# Altium schematic sheet Memory.SchDoc
size A
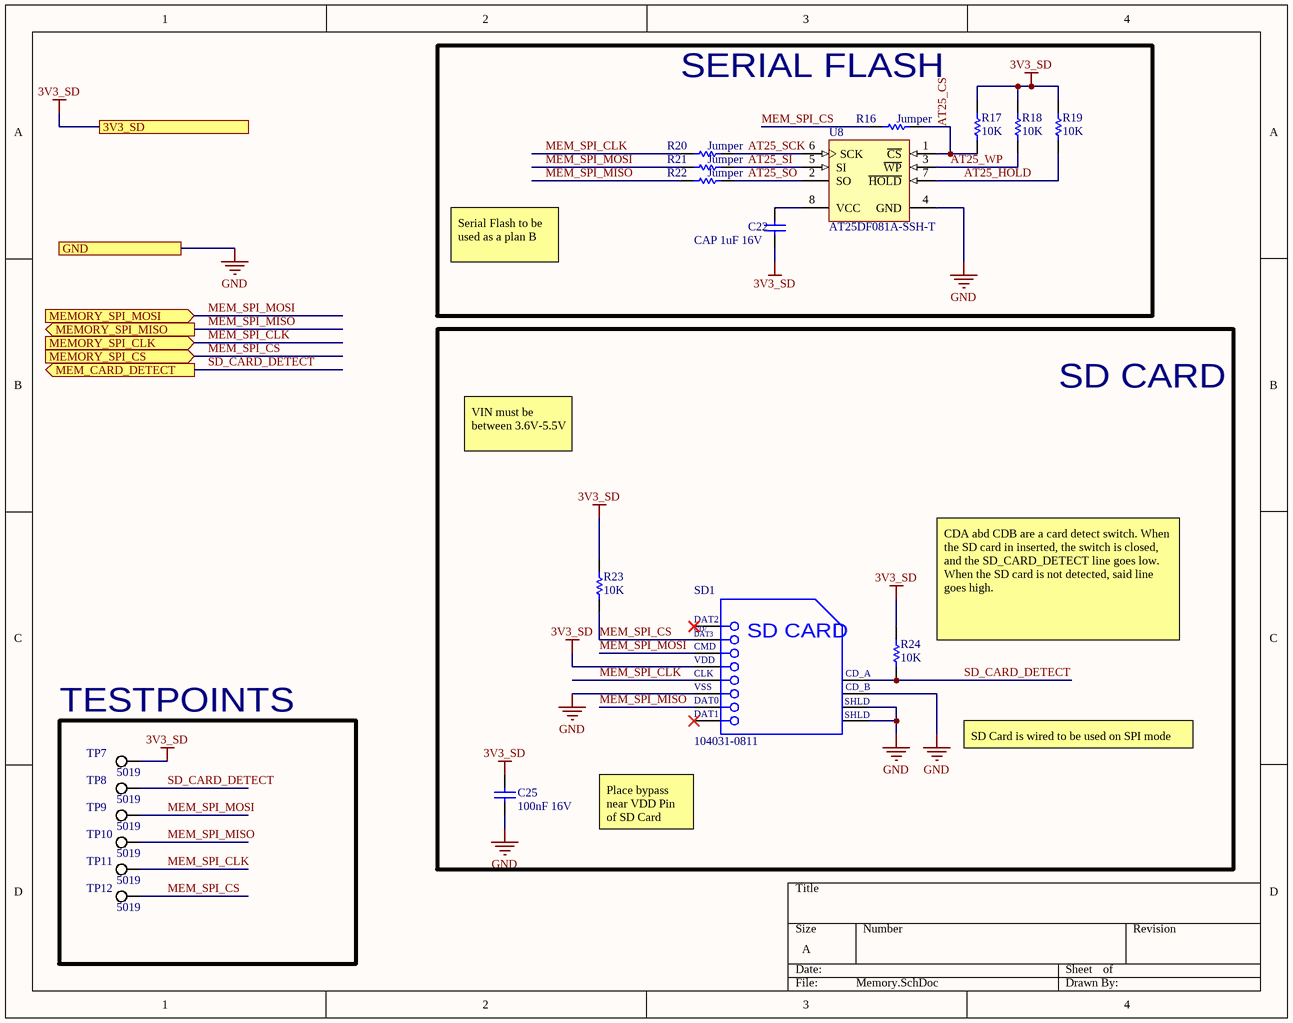
[diagram p0: Memory.SchDoc]

## Parts
C22  CAP 1uF 16V  [CAPC0603(1608)100_N]
C25  100nF 16V  [CAPC0603(1608)100_N]
R16  Jumper  [RESC0603(1608)_N]
R17  10K  [RESC0402(1005)_M]
R18  10K  [RESC0402(1005)_M]
R19  10K  [RESC0402(1005)_M]
R20  Jumper  [RESC0603(1608)_N]
R21  Jumper  [RESC0603(1608)_N]
R22  Jumper  [RESC0603(1608)_N]
R23  10K  [RESC0402(1005)_M]
R24  10K  [RESC0402(1005)_M]
SD1  104031-0811  [MOLX-104031-0811_V]
TP7  5019  [KSTN-5019_V]
TP8  5019  [KSTN-5019_V]
TP9  5019  [KSTN-5019_V]
TP10  5019  [KSTN-5019_V]
TP11  5019  [KSTN-5019_V]
TP12  5019  [KSTN-5019_V]
U8  AT25DF081A-SSH-T  [AT25DF081A-SSH-T]

## Blocks framed on the sheet
SERIAL FLASH: C22 R16-R22 U8
SD CARD: C25 R23 R24 SD1
TESTPOINTS: TP7-TP12

## Ports
3V3_SD, GND, MEM_CARD_DETECT (out), MEMORY_SPI_CLK (in), MEMORY_SPI_CS (in), MEMORY_SPI_MISO (out), MEMORY_SPI_MOSI (in)

## Nets
3V3_SD: C22.1 C25.2 R17.1 R18.1 R19.1 R23.1 R24.1 SD1.4(VDD) TP7.1 ; port 3V3_SD
GND: C25.1 SD1.6(VSS2) SD1.10(CD_B) SD1.11(SHLD1) SD1.12(SHLD2) U8.4(GND) ; port GND
AT25_CS: R16.2 R17.2 U8.1(~{CS})
AT25_HOLD: R19.2 U8.7(~{HOLD})
AT25_SCK: R20.2 U8.6(SCK)
AT25_SI: R21.2 U8.5(SI)
AT25_SO: R22.2 U8.2(SO)
AT25_WP: R18.2 U8.3(~{WP})
MEM_SPI_CLK: R20.1 SD1.5(CLK) TP11.1 ; port MEMORY_SPI_CLK
MEM_SPI_CS: R16.1 R23.2 SD1.2(CMD) TP12.1 ; port MEMORY_SPI_CS
MEM_SPI_MISO: R22.1 SD1.7(DAT0) TP10.1 ; port MEMORY_SPI_MISO
MEM_SPI_MOSI: R21.1 SD1.3(VSS1) TP9.1 ; port MEMORY_SPI_MOSI
SD_CARD_DETECT: R24.2 SD1.9(CD_A) TP8.1 ; port MEM_CARD_DETECT
NetC22_2: C22.2 U8.8(VCC)

Not connected (* = marked no-connect by the designer): SD1 1(CD/DAT3)* 8(DAT1)*

## Notes on the sheet
- Serial Flash to be used as a plan B
- VIN must be between 3.6V-5.5V
- (near R24) CDA abd CDB are a card detect switch. When the SD card in inserted, the switch is closed, and the SD_CARD_DETECT line goes low. When the SD card is not detected, said line goes high.
- SD Card is wired to be used on SPI mode
- Place bypass near VDD Pin of SD Card
- (in symbol CMP-2000-05825-1) DAT2; CD/; DAT3; SD CARD; VSS; SHLD

## Library data of the parts
C22 = CMP-1035-02737-1: CAP 1uF 16V ±10% 0603 (1608 Metric) Thickness 1mm SMD; Case-Metric: 1608; Tolerance: Â±10%; Case-EIA: 0603; Rated Voltage: 16 V; Max Thickness: 1 mm; Technology: SMT; Value: 1uF
C25 = CMP-1035-02584-1: CAP 100nF 16V ±10% 0603 (1608 Metric) Thickness 1mm SMD; Tolerance: Â±10%; Case-EIA: 0603; Case-Metric: 1608; Technology: SMT; Max Thickness: 1 mm; Value: 100nF; Rated Voltage: 16 V
R16 R20-R22 = CMP-1012-00001-1: Jumper 0603 (1608 Metric); Case-Metric: 1608; Value: 0.00 Ohm; Power: None; Case-EIA: 0603; Technology: SMT; Tolerance: None
R17-R19 R23 R24 = CMP-1011-00098-1: 10K 0.063W 5% 0402 (1005 Metric)  SMD; Case-Metric: 1005; Value: 10000.00 Ohm; Case-EIA: 0402; Technology: SMT; Tolerance: 5 %; Power: 0.063 W
SD1 = CMP-2000-05825-1: Micro SD Card, RA, -25 to 85 degC, 8-Pin SMD, RoHS, Tape and Reel; Voltage Rating: 10VAC/DC; Number of Contacts: 8; Insertion - Extraction Style: Push-Pull; Pitch: 1.1mm; Mating Cycles: 10000; Brand: Molex; Current Rating: 500mA; Manufacturer URL: http://www.molex.com/; Card Type: microSD; Mounting Type: Standard; Height: 1.42mm; Mounting Technology: SurfaceMount; Contact Plating: Gold; Product Category: MemoryCardConnectors; Package Description: 8-Pin Surface Mount Device, Body 11.95 x 11.4 mm, Pitch 1.1 mm; Datasheet URL: http://www.molex.com/pdm_docs/sd/1040310811_sd.pdf; Termination Style: SMD; Length: 11.4mm; Housing Material: LiquidCrystalPolymer(LCP); Orientation: RightAngle; RoHS: True; Contact Material: PhosphorBronze; Datasheet Version: Rev. E, 04/2006; Packaging: Reel; Manufacturer: Molex; Series: 104031; Product: CardConnectors; Number of Rows: 1Row; Package Reference: 104031-0811
TP7-TP12 = CMP-1672-00008-1: Test Point, 1 Position SMD, RoHS, Tape and Reel; ComponentLink1Description: Manufacturer URL; Package Quantity: 1000; DatasheetVersion: 03/2014; Packaging: Tape and Reel; ComponentLink2URL: http://www.keyelco.com/product-pdf.cfm?p=1357; ComponentLink1URL: http://www.keyelco.com/; Mount: Surface Mount; Contact Plating: Silver; PackageDescription: 1-Pin Surface Mount Device, Body 3.81 x 2.03 mm; Pins: 1; RoHSCompliant: True; Mounting Technology: Surface Mount; ComponentLink2Description: Datasheet; PackageReference: 5019
U8 = AT25DF081A-SSH-T: IC FLASH 8MBIT 100MHZ 8SOIC; Manufacturer: Adesto Technologies; Memory Size: 8M (4096 pages x 256 bytes); Interface: SPI, RapidS; Voltage - Supply: 2.7 V ~ 3.6 V; Rad Hard: No; Manufacturer Part Number: AT25DF081A-SSH-T; RoHS: RoHS Compliant; Category: Integrated Circuits (ICs); Packaging: Cut Tape (CT); Part Status: Active; Format - Memory: FLASH; Memory Type: FLASH; Speed: 100MHz; Operating Temperature: -40°C ~ 85°C (TC); Package / Case: 8-SOIC (0.154", 3.90mm Width); Supplier Device Package: 8-SOIC; ComponentLink1URL: http://www.adestotech.com/wp-content/uploads/doc8715.pdf; ComponentLink1Description: http://www.adestotech.com/wp-content/uploads/doc8715.pdf; Supplier 1: Digikey; Stock 1: 2550; Pricing 1: 1=1.18, 10=1.081, 25=1.0516, 50=1.0462, 100=0.9352, 250=0.9324, 500=0.9185, 1000=0.8791 (USD); Package: 8SOIC; ComponentLink2URL: https://datasheet.ciiva.com/14084/doc8715-14084443.pdf; ComponentLink2Description: https://datasheet.ciiva.com/14084/doc8715-14084443.pdf; ComponentLink3URL: https://datasheet.ciiva.com/26910/getdatasheetpartid-730210-26910875.pdf; ComponentLink3Description: https://datasheet.ciiva.com/26910/getdatasheetpartid-730210-26910875.pdf; ComponentLink4URL: https://datasheet.ciiva.com/12251/doc8715-12251468.pdf; ComponentLink4Description: https://datasheet.ciiva.com/12251/doc8715-12251468.pdf; Supplier Part Number 1: 1265-1166-1-ND